# Altium schematic sheet EFR32MG24_Minimum_BOM_REF_DES_A00_TITLE_PAGE.SchDoc
size 420 x 297 mm; SheetNumber: 1; SheetTotal: 2
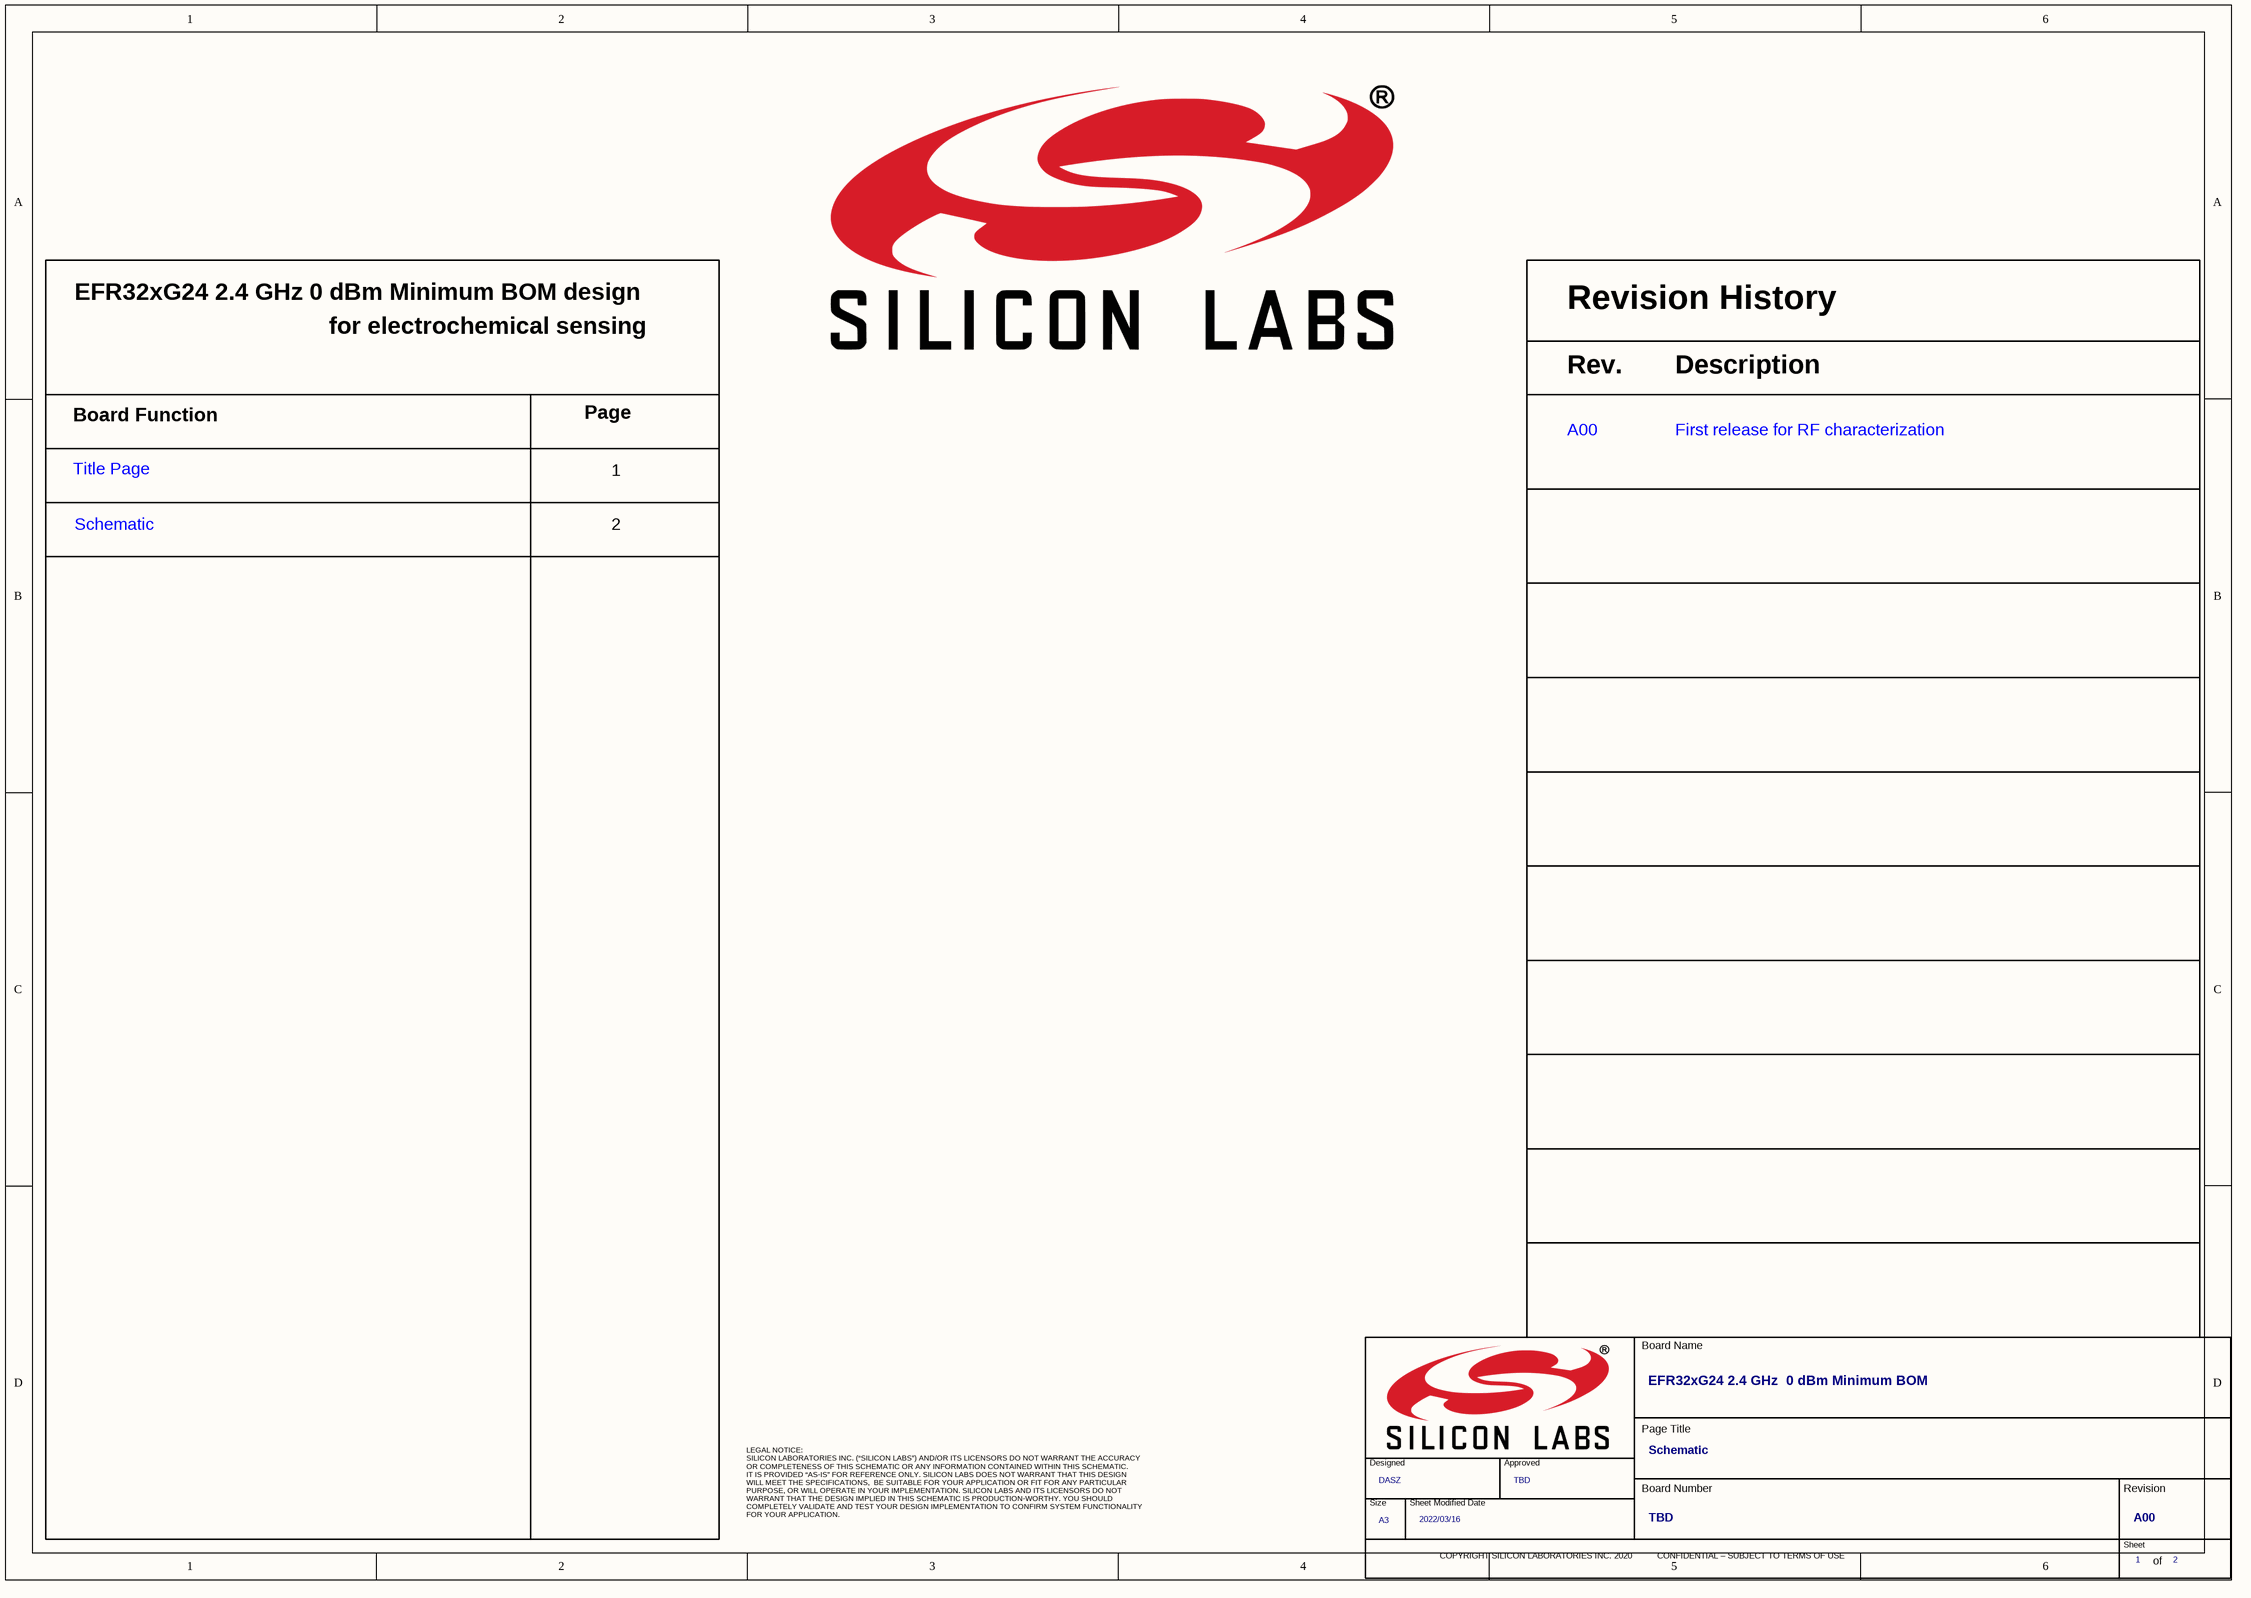
[diagram p0: EFR32MG24_Minimum_BOM_REF_DES_A00_TITLE_PAGE.SchDoc]

## Parts
(Parts that share a designator on the sheet are numbered #1, #2 ... from top to bottom, then left to right.)
*  Header B: for electrochemical sensing  Header A: EFR32xG24 2.4 GHz 0 dBm Minimum BOM design  (hidden comment: Toc_Header)  (graphical)
*?#1  Dscr1A: First release for RF characterization  Rev1: A00  (hidden comment: Rev_History)  (graphical)
*?#2  Doc: TBD  RevCode: A00  Board Designer: DASZ  Page Title: Schematic  Page Size: A3  Page Number: 1  Page Count: 2  Title: EFR32xG24 2.4 GHz  0 dBm Minimum BOM  Page Modify Date: 2022/03/16  (hidden comment: TitleBlock_SiliconLabs_A3)  (graphical)

## Notes on the sheet
- Board Function
- Page
- Title Page
- Schematic
- 1
- 2
- LEGAL NOTICE:
  SILICON LABORATORIES INC. (“SILICON LABS”) AND/OR ITS LICENSORS DO NOT WARRANT THE ACCURACY
  OR COMPLETENESS OF THIS SCHEMATIC OR ANY INFORMATION CONTAINED WITHIN THIS SCHEMATIC.
  IT IS PROVIDED “AS-IS” FOR REFERENCE ONLY. SILICON LABS DOES NOT WARRANT THAT THIS DESIGN
  WILL MEET THE SPECIFICATIONS,  BE SUITABLE FOR YOUR APPLICATION OR FIT FOR ANY PARTICULAR
  PURPOSE, OR WILL OPERATE IN YOUR IMPLEMENTATION. SILICON LABS AND ITS LICENSORS DO NOT
  WARRANT THAT THE DESIGN IMPLIED IN THIS SCHEMATIC IS PRODUCTION-WORTHY. YOU SHOULD
  COMPLETELY VALIDATE AND TEST YOUR DESIGN IMPLEMENTATION TO CONFIRM SYSTEM FUNCTIONALITY
  FOR YOUR APPLICATION.
- (in symbol Rev_History) Revision History; Rev.; Description
- (in symbol TitleBlock_SiliconLabs_A3) Board Name; Page Title; Designed; Approved; Board Number; Revision; Size; Sheet Modified Date; Sheet; COPYRIGHT SILICON LABORATORIES INC. 2020          CONFIDENTIAL – SUBJECT TO TERMS OF USE; of

## Library data of the parts
*?#1 = Rev_History: Dscr4B: h; Dscr5B: j; Dscr4A: g; Dscr6B: l; Dscr5A: i; Dscr7B: n; Dscr6A: k; Dscr8B: p; Dscr7A: m; Dscr9B: r; Dscr8A: o; Dscr9A: q; Dscr1B: b; Dscr2B: d; Dscr3B: f; Dscr3A: e; Rev9: 9; Rev8: 8; Rev7: 7; Rev6: 6; Rev5: 5; Rev4: 4; Rev3: 3; RevCode: PA00*
*?#2 = TitleBlock_SiliconLabs_A3: Board Approver: TBD; OrgName: Silicon Labs